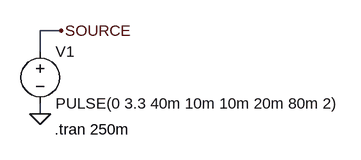
[diagram p0: schematic Fig_2-32_V-source-PULSE.asc]
Fig_2-32_V-source-PULSE.asc, the LTspice schematic file:
Version 4
SHEET 1 880 680
WIRE 80 112 48 112
WIRE 48 144 48 112
WIRE 48 240 48 224
FLAG 48 240 0
FLAG 80 112 SOURCE
SYMBOL voltage 48 128 R0
WINDOW 123 0 0 Left 0
WINDOW 39 0 0 Left 0
SYMATTR InstName V1
SYMATTR Value PULSE(0 3.3 40m 10m 10m 20m 80m 2)
TEXT 70 264 Left 2 !.tran 250m

The netlist it stands for:
* Fig_2-32_V-source-PULSE.asc
V1 SOURCE 0 PULSE(0 3.3 40m 10m 10m 20m 80m 2)
.tran 250m
.backanno
.end